# Altium project DDR4_MotherboardV2.PrjPcb
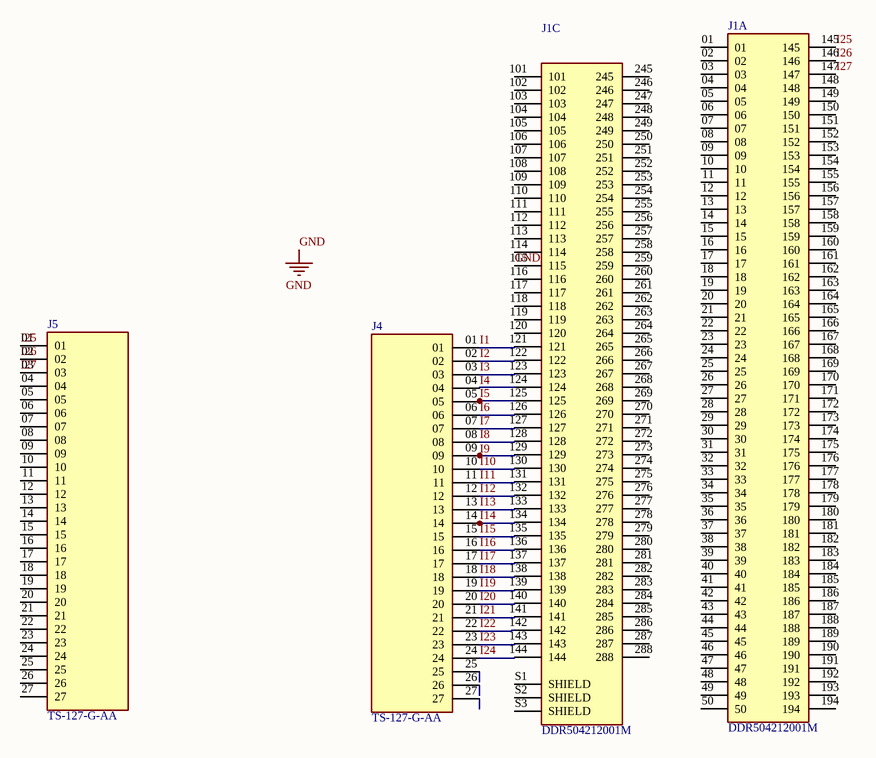
[diagram p0: DDR4_MotherboardV2.SchDoc]
1 sheet, 3 parts. Net scope: global (net labels, ports and power ports of the same name join across sheets).
Board file: DDR4_MotherboardV2.PcbDoc

## Sheet DDR4_MotherboardV2.SchDoc
size A; SheetNumber: 1; SheetTotal: 1

### Parts
J1  DDR504212001M  [AMPHENOL_DDR504212001M]  (parts A,C of 3)
J4  TS-127-G-AA  [SAMTEC_TS-127-G-AA]
J5  TS-127-G-AA  [SAMTEC_TS-127-G-AA]

### Nets
GND: J1.115
I1: J1.121 J4.01
I2: J1.122 J4.02
I3: J1.123 J4.03
I4: J1.124 J4.04
I5: J1.125 J4.05
I6: J1.126 J4.06
I7: J1.127 J4.07
I8: J1.128 J4.08
I9: J1.129 J4.09
I10: J1.130 J4.10
I11: J1.131 J4.11
I12: J1.132 J4.12
I13: J1.133 J4.13
I14: J1.134 J4.14
I15: J1.135 J4.15
I16: J1.136 J4.16
I17: J1.137 J4.17
I18: J1.138 J4.18
I19: J1.139 J4.19
I20: J1.140 J4.20
I21: J1.141 J4.21
I22: J1.142 J4.22
I23: J1.143 J4.23
I24: J1.144 J4.24
I25: J1.145 J5.01
I26: J1.146 J5.02
I27: J1.147 J5.03

Not connected (* = marked no-connect by the designer): J1 01 02 03 04 05 06 07 08 09 10 11 12 13 14 15 16 17 18 19 20 21 22 23 24 25 26 27 28 29 30 31 32 33 34 35 36 37 38 39 40 41 42 43 44 45 46 47 48 49 50 101 102 103 104 105 106 107 108 109 110 111 112 113 114 116 117 118 119 120 148 149 150 151 152 153 154 155 156 157 158 159 160 161 162 163 164 165 166 167 168 169 170 171 172 173 174 175 176 177 178 179 180 181 182 183 184 185 186 187 188 189 190 191 192 193 194 245 246 247 248 249 250 251 252 253 254 255 256 257 258 259 260 261 262 263 264 265 266 267 268 269 270 271 272 273 274 275 276 277 278 279 280 281 282 283 284 285 286 287 288 S1(SHIELD) S2(SHIELD) S3(SHIELD); J4 25 26 27; J5 04 05 06 07 08 09 10 11 12 13 14 15 16 17 18 19 20 21 22 23 24 25 26 27

### Library data of the parts
J1 = CMP-033-000000-1: DDR5 Memory Module Sockets, Storage and Server System, Vertical, Surface Mount, 288 Position, 0.85mm (0.0335in) pitch.; MF: Amphenol FCI; Pin Count: 291; SnapEDA_Link: https://www.snapeda.com/parts/DDR504212001M/Amphenol/view-part/?ref=snap; MP: DDR504212001M; Value: *; Price: None; Check_prices: https://www.snapeda.com/parts/DDR504212001M/Amphenol/view-part/?ref=eda; Package: None; Design Item ID: DDR504212001M; Availability: In Stock; Source: DDR504212001M.SchLib; Component Type: Standard
J4 J5 = CMP-029-000000-1: Connector Header position; MF: Samtec; Price: None; Source: TS-127-G-AA.SchLib; Purchase-URL: https://pricing.snapeda.com/search/part/TS-127-G-AA/?ref=eda; MP: TS-127-G-AA; Pin Count: 27; Check_prices: https://www.snapeda.com/parts/TS-127-G-AA/Samtec/view-part/?ref=eda; Value: *; Design Item ID: TS-127-G-AA; Package: None; Availability: In Stock; SnapEDA_Link: https://www.snapeda.com/parts/TS-127-G-AA/Samtec/view-part/?ref=snap; Component Type: Standard